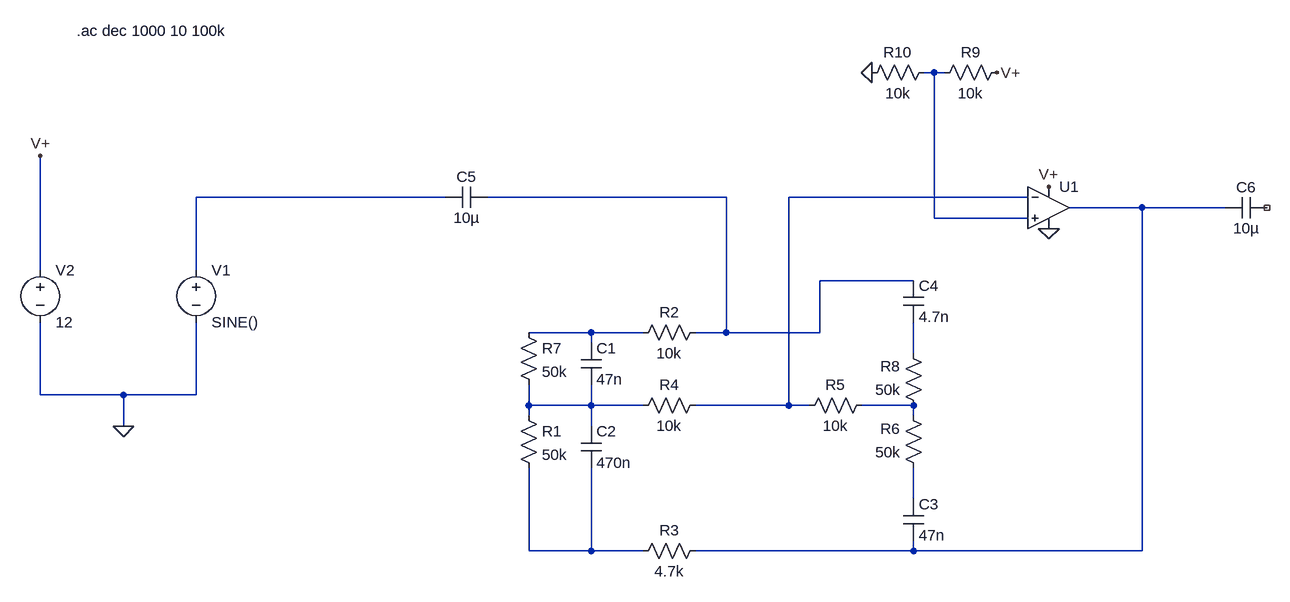
[diagram p0: schematic Draft1.asc]
Draft1.asc, the LTspice schematic file:
Version 4
SHEET 1 1352 680
WIRE 832 -336 816 -336
WIRE 848 -336 832 -336
WIRE 80 -144 -304 -144
WIRE 512 -144 144 -144
WIRE 976 -144 608 -144
WIRE 1152 -128 1040 -128
WIRE 1280 -128 1152 -128
WIRE 832 -112 832 -336
WIRE 976 -112 832 -112
WIRE -544 -32 -544 -208
WIRE -304 -32 -304 -144
WIRE 800 -16 656 -16
WIRE 304 64 208 64
WIRE 384 64 304 64
WIRE 512 64 512 -144
WIRE 512 64 464 64
WIRE 656 64 656 -16
WIRE 656 64 512 64
WIRE 304 80 304 64
WIRE 800 96 800 48
WIRE -544 160 -544 48
WIRE -416 160 -544 160
WIRE -304 160 -304 48
WIRE -304 160 -416 160
WIRE 208 176 208 144
WIRE 304 176 304 144
WIRE 304 176 208 176
WIRE 384 176 304 176
WIRE 608 176 608 -144
WIRE 608 176 464 176
WIRE 640 176 608 176
WIRE 800 176 720 176
WIRE 208 192 208 176
WIRE 800 192 800 176
WIRE -416 208 -416 160
WIRE 304 208 304 176
WIRE 800 320 800 272
WIRE 208 400 208 272
WIRE 304 400 304 272
WIRE 304 400 208 400
WIRE 384 400 304 400
WIRE 800 400 800 384
WIRE 800 400 464 400
WIRE 1152 400 1152 -128
WIRE 1152 400 800 400
FLAG -416 208 0
FLAG -544 -208 V+
FLAG 1008 -160 V+
FLAG 1008 -96 0
FLAG 928 -336 V+
FLAG 736 -336 0
SYMBOL res 192 176 R0
SYMATTR InstName R1
SYMATTR Value 50k
SYMBOL res 480 48 R90
WINDOW 0 0 56 VBottom 2
WINDOW 3 32 56 VTop 2
SYMATTR InstName R2
SYMATTR Value 10k
SYMBOL res 480 384 R90
WINDOW 0 0 56 VBottom 2
WINDOW 3 32 56 VTop 2
SYMATTR InstName R3
SYMATTR Value 4.7k
SYMBOL res 480 160 R90
WINDOW 0 0 56 VBottom 2
WINDOW 3 32 56 VTop 2
SYMATTR InstName R4
SYMATTR Value 10k
SYMBOL res 736 160 R90
WINDOW 0 0 56 VBottom 2
WINDOW 3 32 56 VTop 2
SYMATTR InstName R5
SYMATTR Value 10k
SYMBOL res 816 288 R180
WINDOW 0 36 76 Left 2
WINDOW 3 36 40 Left 2
SYMATTR InstName R6
SYMATTR Value 50k
SYMBOL cap 288 80 R0
SYMATTR InstName C1
SYMATTR Value 47n
SYMBOL cap 288 208 R0
SYMATTR InstName C2
SYMATTR Value 470n
SYMBOL cap 784 320 R0
SYMATTR InstName C3
SYMATTR Value 47n
SYMBOL cap 784 -16 R0
SYMATTR InstName C4
SYMATTR Value 4.7n
SYMBOL res 192 48 R0
SYMATTR InstName R7
SYMATTR Value 50k
SYMBOL res 816 192 R180
WINDOW 0 36 76 Left 2
WINDOW 3 36 40 Left 2
SYMATTR InstName R8
SYMATTR Value 50k
SYMBOL cap 144 -160 R90
WINDOW 0 0 32 VBottom 2
WINDOW 3 32 32 VTop 2
SYMATTR InstName C5
SYMATTR Value 10µ
SYMBOL UniversalOpamp2 1008 -128 R0
SYMATTR InstName U1
SYMBOL voltage -304 -48 R0
SYMATTR InstName V1
SYMATTR Value SINE()
SYMATTR Value2 AC 1
SYMBOL voltage -544 -48 R0
SYMATTR InstName V2
SYMATTR Value 12
SYMBOL res 944 -352 R90
WINDOW 0 0 56 VBottom 2
WINDOW 3 32 56 VTop 2
SYMATTR InstName R9
SYMATTR Value 10k
SYMBOL res 832 -352 R90
WINDOW 0 0 56 VBottom 2
WINDOW 3 32 56 VTop 2
SYMATTR InstName R10
SYMATTR Value 10k
SYMBOL cap 1344 -144 R90
WINDOW 0 0 32 VBottom 2
WINDOW 3 32 32 VTop 2
SYMATTR InstName C6
SYMATTR Value 10µ
TEXT -488 -400 Left 2 !.ac dec 1000 10 100k

The netlist it stands for:
* Draft1.asc
R1 N008 N011 50k
R2 N003 N006 10k
R3 N005 N011 4.7k
R4 N004 N008 10k
R5 N009 N004 10k
R6 N010 N009 50k
C1 N006 N008 47n
C2 N008 N011 470n
C3 N010 N005 47n
C4 N003 N007 4.7n
R7 N006 N008 50k
R8 N009 N007 50k
C5 N003 N002 10µ
XU1 N001 N004 V+ 0 N005 level.2 Avol=1Meg GBW=10Meg Slew=10Meg ilimit=25m rail=0 Vos=0 phimargin=45 en=0 enk=0 in=0 ink=0 Rin=500Meg  ; pins IN+ IN- V+ V- OUT
V1 N002 0 SINE() AC 1
V2 V+ 0 12
R9 V+ N001 10k
R10 N001 0 10k
C6 NC_01 N005 10µ
.ac dec 1000 10 100k
.lib UniversalOpamps2.sub
.backanno
.end